# Altium schematic sheet PC_Overview_Block.SchDoc: Payload Computer - Overview
size A3; Engineer: Matt Brindley; Organization: BLUEsat Project; Address1: Room 419; Address2: School of EE&T; Address3: UNSW, NSW 2052; Address4: Australia; Revision: 0.1; SheetNumber: 1; SheetTotal: ?
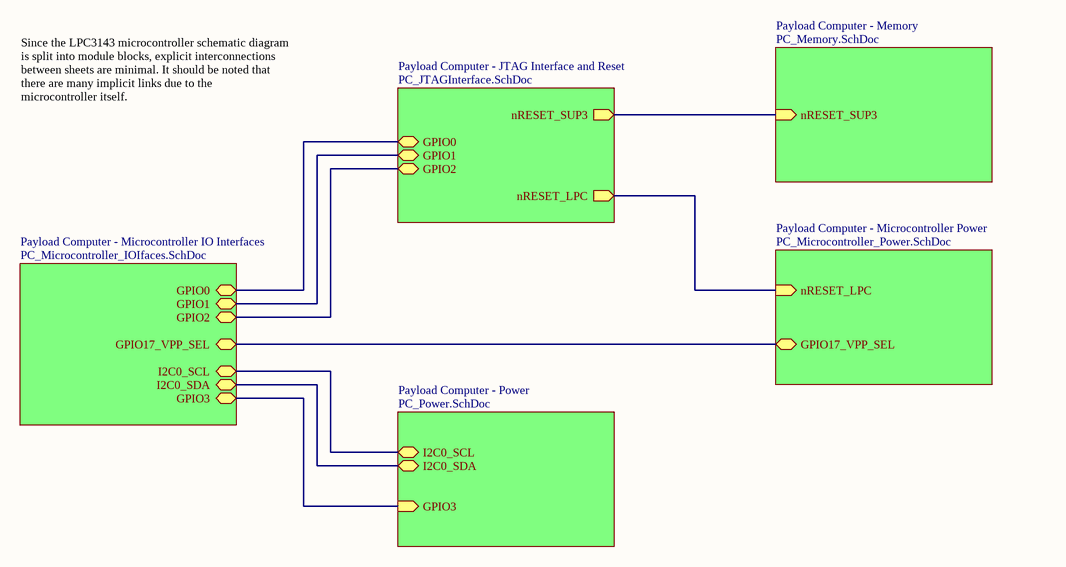
[diagram p0: PC_Overview_Block.SchDoc]

## Sub-sheets
Payload Computer - JTAG Interface and Reset = PC_JTAGInterface.SchDoc: GPIO0 (bidir), GPIO1 (bidir), GPIO2 (bidir), nRESET_LPC (out), nRESET_SUP3 (out)
Payload Computer - Memory = PC_Memory.SchDoc: nRESET_SUP3 (in)
Payload Computer - Microcontroller IO Interfaces = PC_Microcontroller_IOIfaces.SchDoc: GPIO1 (bidir), GPIO2 (bidir), GPIO3 (bidir), GPIO17_VPP_SEL (bidir), I2C0_SCL (bidir), I2C0_SDA (bidir), GPIO0 (bidir)
Payload Computer - Microcontroller Power = PC_Microcontroller_Power.SchDoc: GPIO17_VPP_SEL (bidir), nRESET_LPC (in)
Payload Computer - Power = PC_Power.SchDoc: I2C0_SCL (bidir), I2C0_SDA (bidir), GPIO3 (in)

## Nets
(unnamed): sheet Payload Computer - Power/I2C0_SCL, sheet Payload Computer - Microcontroller IO Interfaces/I2C0_SCL
(unnamed): sheet Payload Computer - Power/I2C0_SDA, sheet Payload Computer - Microcontroller IO Interfaces/I2C0_SDA
(unnamed): sheet Payload Computer - Power/GPIO3, sheet Payload Computer - Microcontroller IO Interfaces/GPIO3
(unnamed): sheet Payload Computer - Microcontroller Power/GPIO17_VPP_SEL, sheet Payload Computer - Microcontroller IO Interfaces/GPIO17_VPP_SEL
(unnamed): sheet Payload Computer - Microcontroller Power/nRESET_LPC, sheet Payload Computer - JTAG Interface and Reset/nRESET_LPC
(unnamed): sheet Payload Computer - Memory/nRESET_SUP3, sheet Payload Computer - JTAG Interface and Reset/nRESET_SUP3
(unnamed): sheet Payload Computer - Microcontroller IO Interfaces/GPIO1, sheet Payload Computer - JTAG Interface and Reset/GPIO1
(unnamed): sheet Payload Computer - Microcontroller IO Interfaces/GPIO2, sheet Payload Computer - JTAG Interface and Reset/GPIO2
(unnamed): sheet Payload Computer - Microcontroller IO Interfaces/GPIO0, sheet Payload Computer - JTAG Interface and Reset/GPIO0

## Notes on the sheet
- Since the LPC3143 microcontroller schematic diagram is split into module blocks, explicit interconnections between sheets are minimal. It should be noted that there are many implicit links due to the microcontroller itself.
- Title
- Size:
- Date:
- A3
- Author:
- Time:
- Revision:
- Sheet
- of
- File: